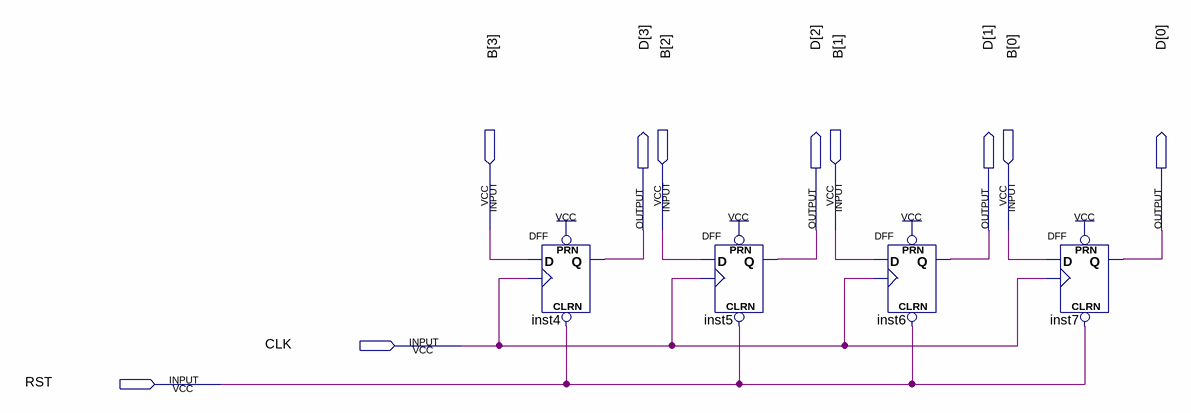
[diagram p0: schematic sheet]
// Quartus schematic Reg4bit.bdf as structural Verilog: 4 symbols, 10 pins
module Reg4bit (
  input  [3:0] B,
  input  CLK,
  input  RST,
  output [3:0] D
);

  DFF inst4 (.CLRN(RST), .CLK(CLK), .D(B[3]), .PRN(1'b1), .Q(D[3]));
  DFF inst5 (.CLRN(RST), .CLK(CLK), .D(B[2]), .PRN(1'b1), .Q(D[2]));
  DFF inst6 (.CLRN(RST), .CLK(CLK), .D(B[1]), .PRN(1'b1), .Q(D[1]));
  DFF inst7 (.CLRN(RST), .CLK(CLK), .D(B[0]), .PRN(1'b1), .Q(D[0]));
endmodule
